# EAGLE design Wheelmod_rs485 (EAGLE 7.3.0)
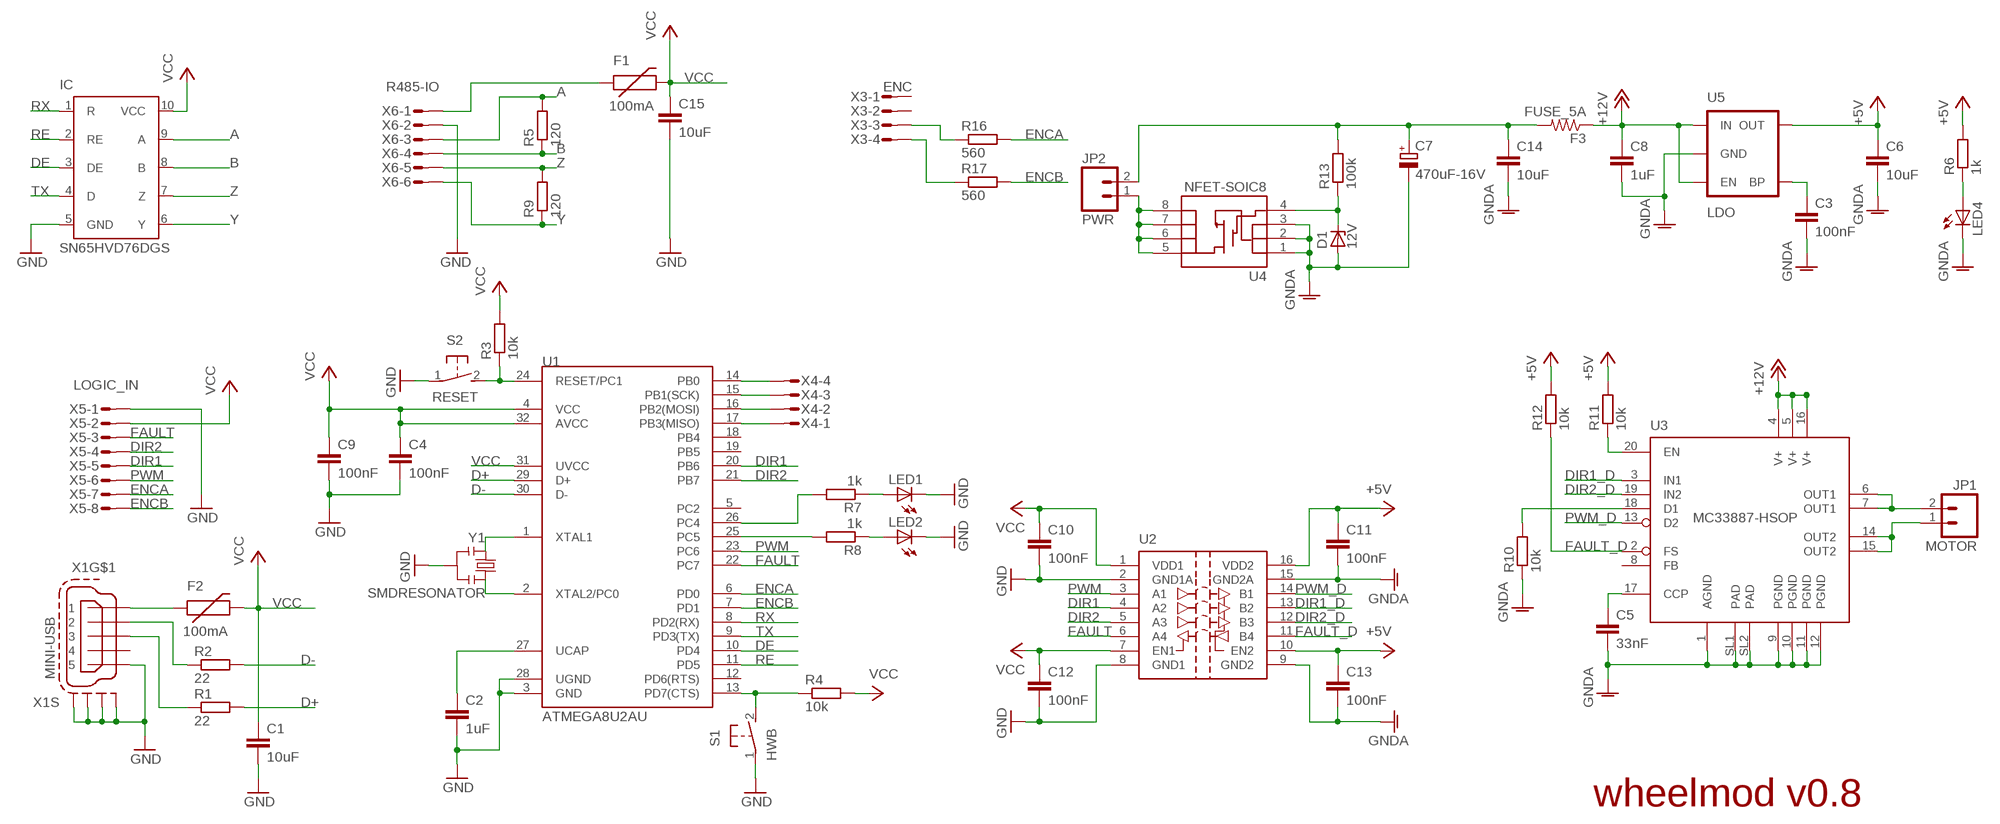
[diagram p0: schematic, sheet 1]

## Parts
C1  10uF  C-EUC1206K  [C1206K]
C2  1uF  C-EUC0603K  [C0603K]
C3  100nF  C-EUC0603K  [C0603K]
C4  100nF  C-EUC0603K  [C0603K]
C5  33nF  C-EUC0603K  [C0603K]
C6  10uF  C-EUC1206K  [C1206K]
C7  470uF-16V  CPOL-EUE3.5-8  [E3,5-8]
C8  1uF  C-EUC0603K  [C0603K]
C9  100nF  C-EUC0603K  [C0603K]
C10  100nF  C-EUC0603K  [C0603K]
C11  100nF  C-EUC0603K  [C0603K]
C12  100nF  C-EUC0603K  [C0603K]
C13  100nF  C-EUC0603K  [C0603K]
C14  10uF  C-EUC1206K  [C1206K]
C15  10uF  C-EUC1206K  [C1206K]
D1  12V  ZENER-DIODESOD123  [SOD123]
F1  100mA  PTCSMD  [PTC-1206]
F2  100mA  PTCSMD  [PTC-1206]
F3  FUSE_5A  R-US_R1206  [R1206]
JP1  MOTOR  M023.5MM  [SCREWTERMINAL-3.5MM-2]
JP2  PWR  M023.5MM  [SCREWTERMINAL-3.5MM-2]
LED1  LEDCHIP-LED0603  [CHIP-LED0603]
LED2  LEDCHIP-LED0603  [CHIP-LED0603]
LED4  LEDCHIP-LED0603  [CHIP-LED0603]
R1  22  R-EU_R0603  [R0603]
R2  22  R-EU_R0603  [R0603]
R3  10k  R-EU_R0603  [R0603]
R4  10k  R-EU_R0603  [R0603]
R5  120  R-EU_R0603  [R0603]
R6  1k  R-EU_R0603  [R0603]
R7  1k  R-EU_R0603  [R0603]
R8  1k  R-EU_R0603  [R0603]
R9  120  R-EU_R0603  [R0603]
R10  10k  R-EU_R0603  [R0603]
R11  10k  R-EU_R0603  [R0603]
R12  10k  R-EU_R0603  [R0603]
R13  100k  R-EU_R0603  [R0603]
R16  560  R-EU_R0603  [R0603]
R17  560  R-EU_R0603  [R0603]
S1  HWB  ADTSM3  [ADTSM3]
S2  RESET  ADTSM3  [ADTSM3]
U1  ATMEGA8U2AU  [TQFP32-08]
U2  SI8441IS1  [SO16]
U3  MC33887-HSOP  [HSOP]
U4  NFET-SOIC8  MOSFET-NCHANNEL-SOIC8  [SO08]
U5  LDO  V_REG_LDOSMD  [SOT23-5]
U$1  SN65HVF76DGS  [MSOP10]
X1  MINI-USB  MINI-USB-SCHIELD-32005-301  [32005-301]
X3  ENC  MICROMATCH-4  [MICROMATCH-4]
X4  MICROMATCH-4  [MICROMATCH-4]
X5  LOGIC_IN  MICROMATCH-8  [MICROMATCH-8]
X6  R485-IO  MICROMATCH-6  [MICROMATCH-6]
Y1  SMDRESONATOR  SMDRESONATOR45X20  [PBRC-M]

## Nets
+5V: C6.1 C11.1 C13.1 R6.2 R11.2 R12.2 U2.10(EN2) U2.16(VDD2) U5.5(OUT)
+12V: C8.1 F3.1 U3.4(V+) U3.5(V+) U3.16(V+) U5.1(IN) U5.3(EN)
A: R5.2 U$1.9(A) X6.3
B: R5.1 U$1.8(B) X6.4
D+: R1.2 U1.29(D+)
D-: R2.2 U1.30(D-)
DE: U1.10(PD4) U$1.3(DE)
DIR1: U1.20(PB6) U2.4(A2) X5.5
DIR1_D: U2.13(B2) U3.3(IN1)
DIR2: U1.21(PB7) U2.5(A3) X5.4
DIR2_D: U2.12(B3) U3.19(IN2)
ENCA: R16.2 U1.6(PD0) X5.7
ENCB: R17.2 U1.7(PD1) X5.8
FAULT: U1.22(PC7) U2.6(A4) X5.3
FAULT_D: R12.1 U2.11(B4) U3.2(FS)
GND: C1.2 C2.2 C4.2 C9.2 C10.2 C12.2 C15.2 LED1.C LED2.C S1.1 S2.1 U1.3(GND) U1.28(UGND) U2.2(GND1A) U2.8(GND1) U$1.5(GND) X1.5 X1.M1(S:S1) X1.M2(S:S2) X1.M3(S:S3) X1.M4(S:S4) X5.1 X6.2 Y1.2
GNDA: C3.2 C5.2 C6.2 C7.- C8.2 C11.2 C13.2 C14.2 D1.A LED4.C R10.1 U2.9(GND2) U2.15(GND2A) U3.1(AGND) U3.9(PGND) U3.10(PGND) U3.11(PGND) U3.12(PGND) U3.SL1(PAD) U3.SL2(PAD) U4.1(S) U4.2(S) U4.3(S) U5.2(GND)
N$1: C2.1 U1.27(UCAP)
N$2: R4.1 S1.2 U1.13(PD7(CTS))
N$3: LED1.A R7.1
N$4: LED2.A R8.1
N$5: R1.1 X1.3
N$6: F2.1 X1.1
N$7: R2.1 X1.2
N$8: U1.1(XTAL1) Y1.1
N$9: U1.2(XTAL2/PC0) Y1.3
N$10: R3.1 S2.2 U1.24(RESET/PC1)
N$11: C3.1 U5.4(BP)
N$12: R8.2 U1.25(PC5)
N$13: LED4.A R6.1
N$15: C5.1 U3.17(CCP)
N$17: R11.1 U3.20(EN)
N$18: R10.2 U3.18(D1)
N$19: R7.2 U1.26(PC4)
N$20: D1.C R13.1 U4.4(G)
N$21: JP2.1 U4.5(D) U4.6(D) U4.7(D) U4.8(D)
N$23: JP1.2 U3.6(OUT1) U3.7(OUT1)
N$24: U1.14(PB0) X4.4
N$25: JP1.1 U3.14(OUT2) U3.15(OUT2)
N$26: U1.15(PB1(SCK)) X4.3
N$27: U1.16(PB2(MOSI)) X4.2
N$28: R16.1 X3.3
N$29: R17.1 X3.4
N$30: C7.+ C14.1 F3.2 JP2.2 R13.2
N$31: U1.17(PB3(MISO)) X4.1
N$33: F1.1 X6.1
PWM: U1.23(PC6) U2.3(A1) X5.6
PWM_D: U2.14(B1) U3.13(D2)
RE: U1.11(PD5) U$1.2(RE)
RX: U1.8(PD2(RX)) U$1.1(R)
TX: U1.9(PD3(TX)) U$1.4(D)
VCC: C1.1 C4.1 C9.1 C10.1 C12.1 C15.1 F1.2 F2.2 R3.2 R4.2 U1.4(VCC) U1.31(UVCC) U1.32(AVCC) U2.1(VDD1) U2.7(EN1) U$1.10(VCC) X5.2
Y: R9.1 U$1.6(Y) X6.6
Z: R9.2 U$1.7(Z) X6.5
Unconnected: U1.5(PC2) U1.12(PD6(RTS)) U1.18(PB4) U1.19(PB5) U3.8(FB) X1.4 X3.1 X3.2

## Notes on the sheet
- wheelmod v0.8

## Library data of the parts
C1-C6 C8-C15 = rcl:C-EU: CAPACITOR, European symbol
C7 = rcl:CPOL-EU: POLARIZED CAPACITOR, European symbol
D1 = diode:ZENER-DIODE: Z-Diode
F1 F2 = SparkFun:PTC: Resettable Fuse PTC Resettable Fuse. Spark Fun Electronics SKU : COM-08357
F3 = rcl:R-US_: RESISTOR, American symbol
JP1 JP2 = SparkFun:M02: Header 2 Standard 2-pin 0.1" header. Use with straight break away headers (SKU : PRT-00116), right angle break away headers (PRT-00553), swiss pins (PRT-00743), machine pins (PRT-00117), and female headers (PRT-00115). Molex polarized connector foot print use with SKU : PRT-08233 with associated crimp pins and housings.
LED1 LED2 LED4 = led:LED: LED OSRAM: - CHIPLED LG R971, LG N971, LY N971, LG Q971, LY Q971, LO R971, LY R971 LH N974, LH R974 LS Q976, LO Q976, LY Q976 LO Q996 - Hyper CHIPLED LW Q18S LB Q993, LB Q99A, LB R99A - SideLED LS A670, LO A670, LY A670, LG A670, LP A670 LB A673, LV A673, LT A673, LW A673 LH A674 LY A675 LS A676, LA A676, LO A676, LY A676, LW A676 LS A679, LY A679, LG A679 - Hyper Micro SIDELED® LS Y876, LA Y876, LO Y876, LY Y876 LT Y87S - SmartLED LW L88C, LW L88S LB L89C, LB L89S, LG L890 LS L89K, LO L89K, LY L89K LS L896, LA L896, LO L896, LY L896 - TOPLED LS T670, LO T670, LY T670, LG T670, LP T670 LSG T670, LSP T670, LSY T670, LOP T670, LYG T670 LG T671, LOG T671, LSG T671 LB T673, LV T673, LT T673, LW T673 LH T674 LS T676, LA T676, LO T676, LY T676, LB T676, LH T676, LSB T676, LW T676 LB T67C, LV T67C, LT T67C, LS T67K, LO T67K, LY T67K, LW E67C LS E67B, LA E67B, LO E67B, LY E67B, LB E67C, LV E67C, LT E67C LW T67C LS T679, LY T679, LG T679 LS T770, LO T770, LY T770, LG T770, LP T770 LB T773, LV T773, LT T773, LW T773 LH T774 LS E675, LA E675, LY E675, LS T675 LS T776, LA T776, LO T776, LY T776, LB T776 LHGB T686 LT T68C, LB T68C - Hyper Mini TOPLED® LB M676 - Mini TOPLED Santana® LG M470 LS M47K, LO M47K, LY M47K Source: http://www.osram.convergy.de LUXEON: - LUMILED® LXK2-PW12-R00, LXK2-PW12-S00, LXK2-PW14-U00, LXK2-PW14-V00 LXK2-PM12-R00, LXK2-PM12-S00, LXK2-PM14-U00 LXK2-PE12-Q00, LXK2-PE12-R00, LXK2-PE12-S00, LXK2-PE14-T00, LXK2-PE14-U00 LXK2-PB12-K00, LXK2-PB12-L00, LXK2-PB12-M00, LXK2-PB14-N00, LXK2-PB14-P00, LXK2-PB14-Q00 LXK2-PR12-L00, LXK2-PR12-M00, LXK2-PR14-Q00, LXK2-PR14-R00 LXK2-PD12-Q00, LXK2-PD12-R00, LXK2-PD12-S00 LXK2-PH12-R00, LXK2-PH12-S00 LXK2-PL12-P00, LXK2-PL12-Q00, LXK2-PL12-R00 Source: www.luxeon.com KINGBRIGHT: KA-3528ASYC Source: www.kingbright.com
R1-R13 R16 R17 = rcl:R-EU_: RESISTOR, European symbol
S1 S2 = kommunikatsioonimoodul:ADTSM3
U1 = SparkFun:ATMEGA8U2: Atmel 8-bit Microcontroller with 8/16/32K Bystes of ISP Flash and USB Controller. ATmega8U2, ATmega16U2, and ATmega32U2
U2 = silicon-labs:SI8441: Si8441 4 Channel (3/1) Digital Isolator Silicon Labs Si84xx ISOpro digital isolator series. The Si84xx ISOpro digital isolators provide low power galvanic isolation for digital signals. The '41 has three forward and one reverse channel, with output enables. This part is suitable for four wire SPI: unidirectional signals with clock and chip select. They come in speeds of 1Mbps and 150Mbps, and isolation ratings of 1KV, 2.5KV and 5KV. The independent sides use 2.7-5.5V supplies and draw under 5mA per channel. Donald Becker
U3 = mc33887:MC33887-HSOP: 5.0 A H-Bridge with Load Current Feedback
U4 = SparkFun:MOSFET-NCHANNEL-SOIC8: N-Channel MOSFET IRF9410 and NDS8434 are common, SOIC-8 parts.
U5 = SparkFun:V_REG_LDO: Voltage Regulator LDO Standard 150mA LDO voltage regulator in SOT-23 layout. Micrel part MIC5205. BP (by-pass) pin is used to lower output noise with 470pF cap.
U$1 = rs485:SN65HVF76DGS
X1 = con-cypressindustries:MINI-USB-SCHIELD-: MINI USB-B Conector Source: www.cypressindustries.com; OC_FARNELL: unknown; OC_NEWARK: unknown
X3 X4 = con-amp-micromatch:MICROMATCH-4: MicroMaTch 4 7-215464-4 / 0-215464-4 Drawing Number C-215464 DDEController.pdf; MPN: 7-215464-4; OC_FARNELL: 3784629; OC_NEWARK: 19R8124
X5 = con-amp-micromatch:MICROMATCH-8: MicroMaTch 8 7-215464-8 / 0-215464-8 Drawing Number C-215464 DDEController.pdf; MF: FARNELL; MPN: 7-215464-8; OC_FARNELL: 3784642; OC_NEWARK: 26H0301
X6 = con-amp-micromatch:MICROMATCH-6: MicroMaTch 6 7-215464-6 / 0-215464-6 Drawing Number C-215464 DDEController.pdf; MPN: 7-215464-6; OC_FARNELL: 3784630; OC_NEWARK: 19R8125
Y1 = reiko:SMDRESONATOR45X20

## Board
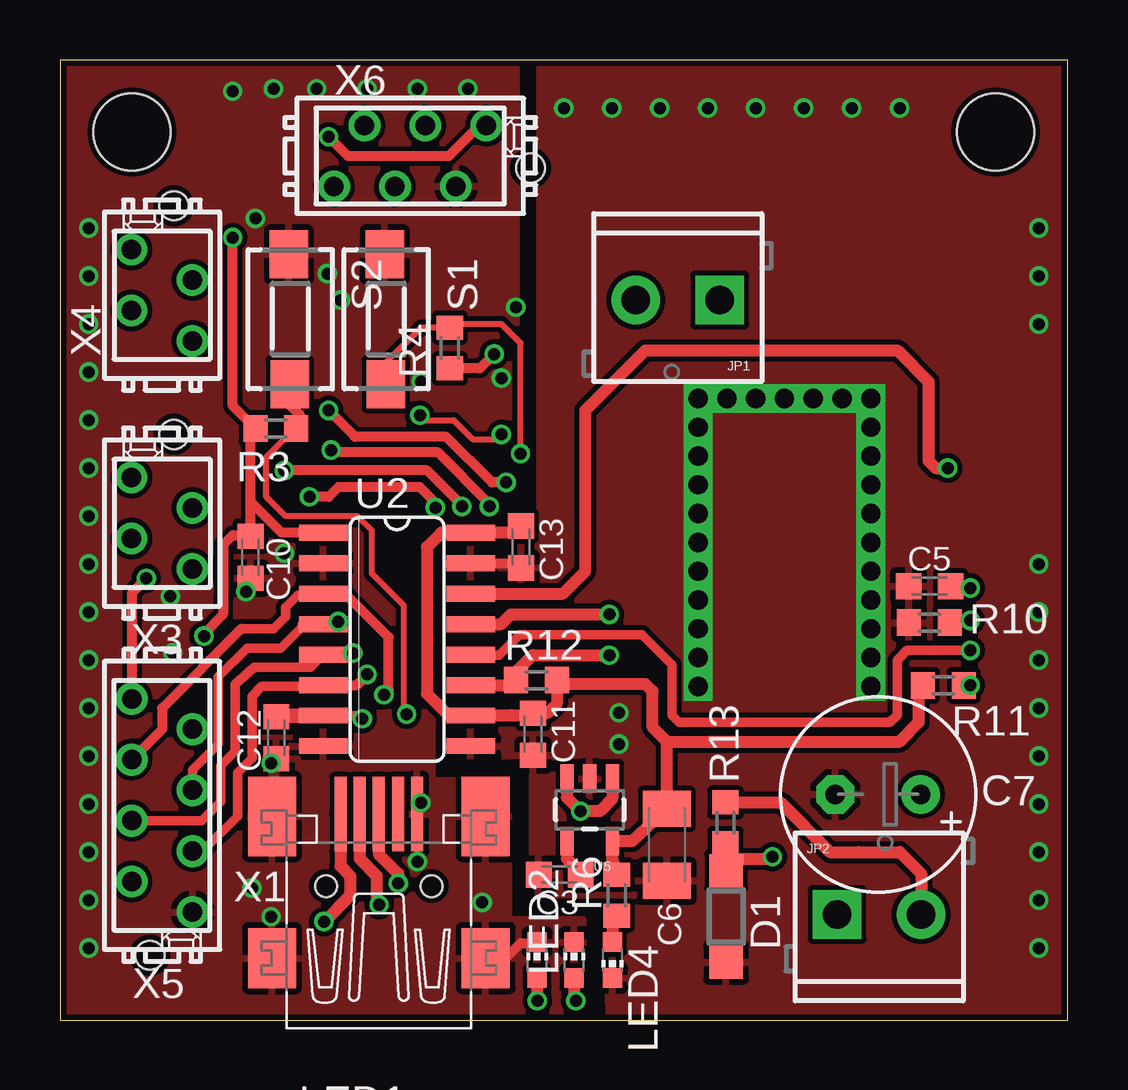
[diagram p1: board, top side]
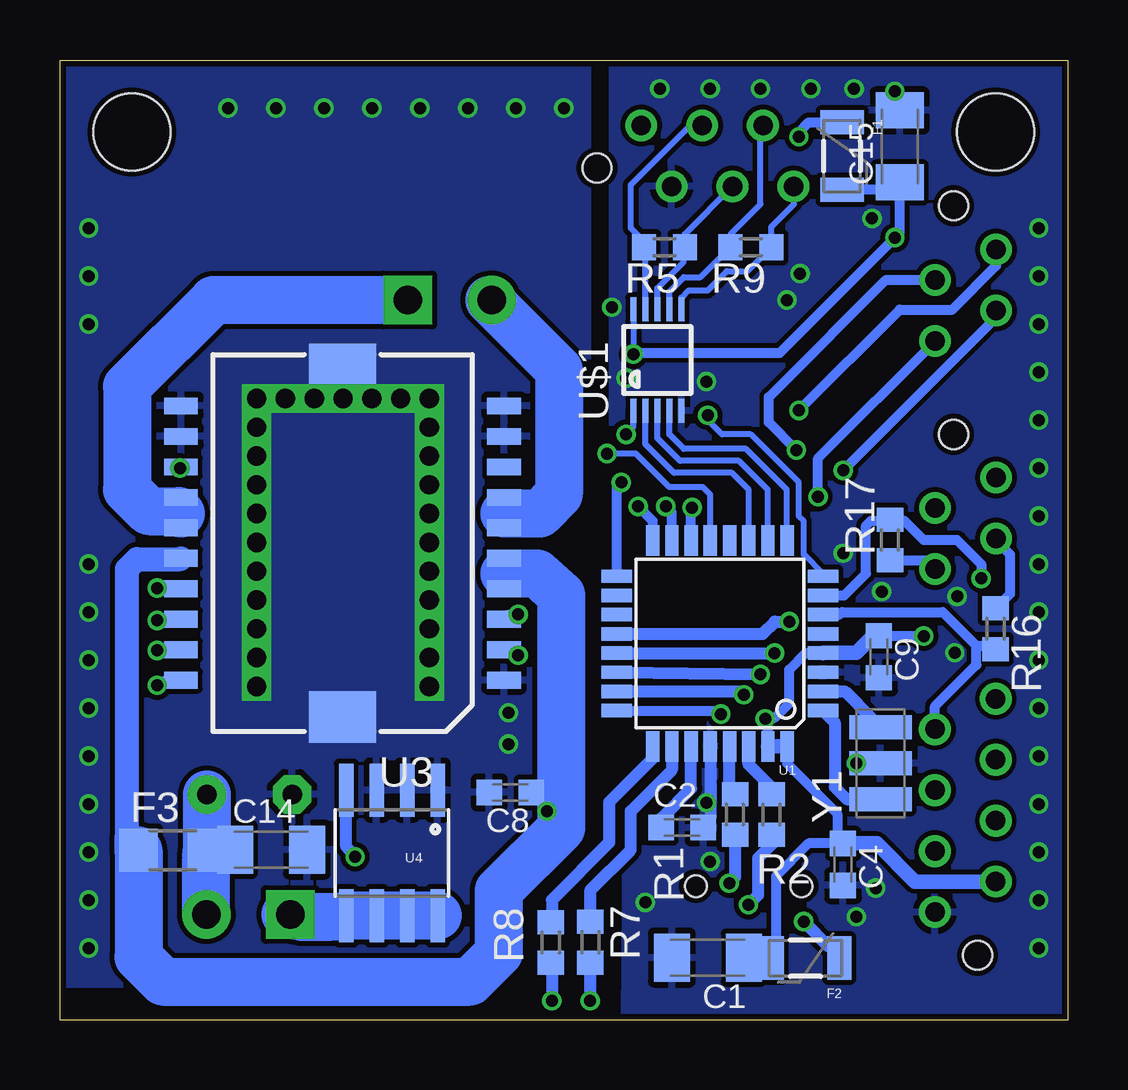
[diagram p2: board, bottom side, seen from below]

Size 42 x 40 mm. Coordinates in mm from the lower left corner, seen from the top.
Outline: 0,0 42,0 42,40 0,40 0,0
Copper layers (1*16): Top 0.035mm / dielectric 1.5mm / Bottom 0.035mm
Design rules "default": minimum track width 6mil, minimum drill 12mil, track to track 8mil, track to pad 8mil, pad to pad 8mil, via to via 8mil, smd to smd 0mil, copper to edge 10mil, drill to drill 10mil, minimum pad ring 10mil, minimum via ring 6mil, stop-mask expansion 2mil, vias tented up to drill 100mil, thermal gap 10mil
Holes 1.2 mm at 3.75,2.7 4.75,24.4 4.75,33.93 19.61,35.5
Holes 3.2 mm at 39,37 3,37
bRestrict: area 10.9,14 to 11.5,14.9

### Footprints (pad centres in the part's own frame; a part is rotated, then mirrored left to right if it is on the bottom)
C1206K = smd 1.5 x 2: 1 -1.5,0; 2 1.5,0
C0603K = smd 1.05 x 1.08: 1 -0.875,0; 2 0.875,0
E3,5-8 = drill 0.813 pad 1.6: + -1.778,0 | drill 0.813 pad 1.6 octagon: - 1.778,0
SOD123 = smd 1.4 x 1.4: A 1.9,0; C -1.9,0
PTC-1206 = smd 1 x 1.8: 1 -1.4,0; 2 1.4,0
R1206 = smd 1.6 x 1.803: 1 -1.422,0; 2 1.422,0
SCREWTERMINAL-3.5MM-2 = drill 1.2 pad 2.032 square: 1 0,0 | drill 1.2 pad 2.032: 2 3.5,0
CHIP-LED0603 = smd 0.8 x 0.8: A 0,-0.75; C 0,0.75
R0603 = smd 1 x 1.1: 1 -0.85,0; 2 0.85,0
ADTSM3 = smd 2 x 1.6: 1 -2.7,-0.06; 2 2.7,-0.02
TQFP32-08 = smd 1.27 x 0.559: 1 -4.293,2.8; 2 -4.293,2; 3 -4.293,1.2; 4 -4.293,0.4; 5 -4.293,-0.4; 6 -4.293,-1.2; 7 -4.293,-2; 8 -4.293,-2.8; 17 4.293,-2.8; 18 4.293,-2; 19 4.293,-1.2; 20 4.293,-0.4; 21 4.293,0.4; 22 4.293,1.2; 23 4.293,2; 24 4.293,2.8 | smd 0.559 x 1.27: 9 -2.8,-4.293; 10 -2,-4.293; 11 -1.2,-4.293; 12 -0.4,-4.293; 13 0.4,-4.293; 14 1.2,-4.293; 15 2,-4.293; 16 2.8,-4.293; 25 2.8,4.293; 26 2,4.293; 27 1.2,4.293; 28 0.4,4.293; 29 -0.4,4.293; 30 -1.2,4.293; 31 -2,4.293; 32 -2.8,4.293
SO16 = smd 0.66 x 2.032: 1 -4.445,-3.073; 2 -3.175,-3.073; 3 -1.905,-3.073; 4 -0.635,-3.073; 5 0.635,-3.073; 6 1.905,-3.073; 7 3.175,-3.073; 8 4.445,-3.073; 9 4.445,3.073; 10 3.175,3.073; 11 1.905,3.073; 12 0.635,3.073; 13 -0.635,3.073; 14 -1.905,3.073; 15 -3.175,3.073; 16 -4.445,3.073
HSOP = smd 0.7 x 1.4: 1 -5.715,-6.731; 2 -4.445,-6.731; 3 -3.175,-6.731; 4 -1.905,-6.731; 5 -0.635,-6.731; 6 0.635,-6.731; 7 1.905,-6.731; 8 3.175,-6.731; 9 4.445,-6.731; 10 5.715,-6.731; 11 5.715,6.731; 12 4.445,6.731; 13 3.175,6.731; 14 1.905,6.731; 15 0.635,6.731; 16 -0.635,6.731; 17 -1.905,6.731; 18 -3.175,6.731; 19 -4.445,6.731; 20 -5.715,6.731 | smd 2.15 x 2.8: SL1 -7.239,0; SL2 7.239,0
SO08 = smd 0.61 x 2.21: 1 -1.905,-2.616; 2 -0.635,-2.616; 3 0.635,-2.616; 4 1.905,-2.616; 5 1.905,2.616; 6 0.635,2.616; 7 -0.635,2.616; 8 -1.905,2.616
SOT23-5 = smd 0.55 x 1.2: 1 -0.95,-1.3; 2 0,-1.3; 3 0.95,-1.3; 4 0.95,1.3; 5 -0.95,1.3
MSOP10 = smd 0.25 x 1: 1 -1,-2.113; 2 -0.5,-2.113; 3 0,-2.113; 4 0.5,-2.113; 5 1,-2.113; 6 1,2.113; 7 0.5,2.113; 8 0,2.113; 9 -0.5,2.113; 10 -1,2.113
32005-301 = smd 3.1 x 0.5: 1 3,1.6; 2 3,0.8; 3 3,0; 4 3,-0.8; 5 3,-1.6 | smd 2.5 x 2: M1 -3,-4.45; M2 -3,4.45 | smd 3.3 x 2: M3 2.9,4.45; M4 2.9,-4.45 | hole 0.9: 0,2.2; 0,-2.2
MICROMATCH-4 = drill 0.813: 1 1.905,1.27; 2 0.635,-1.27; 3 -0.635,1.27; 4 -1.905,-1.27
MICROMATCH-8 = drill 0.813: 1 4.445,1.27; 2 3.175,-1.27; 3 1.905,1.27; 4 0.635,-1.27; 5 -0.635,1.27; 6 -1.905,-1.27; 7 -3.175,1.27; 8 -4.445,-1.27
MICROMATCH-6 = drill 0.813: 1 3.175,1.27; 2 1.905,-1.27; 3 0.635,1.27; 4 -0.635,-1.27; 5 -1.905,1.27; 6 -3.175,-1.27
PBRC-M = smd 1 x 2.6: 1 -1.5,0; 2 0,0; 3 1.5,0

### Placement (x,y rotation side)
C1  15,2.6 180 bottom
C2  16.06,8.02 0 bottom
C3  20.83,6.06 180 top
C4  9.36,6.48 270 bottom
C5  36.25,18.08 180 top
C6  25.3,7.3 270 top
C7  34.1,9.4 180 top
C8  23.23,9.48 180 bottom
C9  7.86,15.13 270 bottom
C10  7.94,19.28 270 top
C11  19.72,11.91 270 top
C12  9.02,11.76 270 top
C13  19.22,19.71 270 top
C14  33.2,7.1 0 bottom
C15  7,36.4 90 bottom
D1  27.77,4.31 270 top
F1  9.4,36 270 bottom
F2  10.92,2.58 180 bottom
F3  37.3,7.07 0 bottom
JP1  27.5,30 180 top
JP2  32.4,4.4 0 top
LED1  19.89,2.5 0 top
LED2  21.43,2.5 0 top
LED4  23.03,2.5 180 top
R1  13.86,8.56 90 bottom
R2  12.34,8.56 90 bottom
R3  9,24.64 180 top
R4  16.25,28 270 top
R5  16.8,32.2 180 bottom
R6  23.21,5.2 90 top
R7  19.89,3.24 90 bottom
R8  21.54,3.23 90 bottom
R9  13.2,32.2 180 bottom
R10  36.24,16.56 0 top
R11  36.82,13.94 180 top
R12  19.86,14.16 0 top
R13  27.74,8.22 90 top
R16  3,16.3 270 bottom
R17  7.4,20 90 bottom
S1  13.6,29.2 270 top
S2  9.6,29.2 270 top
U1  14.49,15.69 180 bottom
U2  14.05,15.86 270 top
U3  30.22,19.87 90 bottom
U4  28.16,6.96 180 bottom
U5  22.08,8.76 180 top
U$1  17.1,27.5 0 bottom
X1  13.29,5.58 90 top
X3  4.25,20.7 90 top
X4  4.25,30.2 90 top
X5  4.26,8.94 270 top
X6  14.6,36 0 top
Y1  7.8,10.7 90 bottom

### Tracks (layer width: path | path; a pad name or v marks a point on that pad's centre or on a via)
+5V
  Top 0.3: 35.8,13.91 R11.2 | 20.85,14 R12.2
  Top 0.5: C13.1 18.74,20.3 U2.16 15.9,20.3 15.3,19.7 15.3,13.6 16.2,12.7 18.81,12.7 U2.10 19.42,12.69 C11.1 20.32,12.79 20.71,13.18 R12.2 | 25.3,11.6 35,11.6 35.8,12.4 35.8,13.91 | R6.2 23.03,6.69 U5.5 23.86,7.46 C6.1 25.3,11.6 | 20.85,14 24.4,14 24.7,13.7 24.7,12.2 25.3,11.6
+12V  (via drill 0.5)
  Top 0.5: U5.1 23.03,9.23 22.5,8.7 v21.7,8.7 21.13,9.27 U5.3
  Bottom 0.5: U3.5 23.49,18.6 U3.4 | v21.7,8.7 21.92,9.74 | 21.92,9.74 21.1,10 | C8.1 22.18,9.48 21.92,9.74
  Bottom 1: F3.1 39.22,7.22 39.2,8.2 39.2,18.8 38.8,19.2 36.99,19.2 U3.16
  Bottom 2: F3.1 38.72,2.62 37.7,1.6 24.9,1.6 23.7,2.8 23.7,5.4 21.1,8 21.1,10 21.1,17.7 22.1,18.6 23.49,18.6
A
  Bottom 0.254: U$1.9 17.6,32.15 R5.2 17.65,32.45 18.2,33 18.2,34.8 15.73,37.27 X6.3
B
  Bottom 0.254: U$1.8 17.1,30.5 16,31.6 16,32.15 R5.1 15.95,32.74 X6.4
D+
  Bottom 0.5: R1.2 14.09,9.53 U1.29
D-
  Bottom 0.3: 13.3,11.39 U1.30
  Bottom 0.5: R2.2 12.34,9.69 13.3,10.65 13.3,11.39
DE
  Bottom 0.254: U$1.3 17.1,24.25 16.15,23.3 13.7,23.3 12.5,22.1 12.5,19.99
  Bottom 0.5: 12.5,19.99 U1.10
DIR1  (via drill 0.5)
  Top 0.3: v11.6,16.6 11.51,16.5 U2.4 10.1,16.5
  Top 0.4: X5.5 5.53,10.43 6.6,11.5 6.6,14.3 7.8,15.5 9.2,15.5 10.1,16.39 10.1,16.5
  Bottom 0.5: U1.20 12.71,16.09 12.2,16.6 v11.6,16.6
DIR1_D  (via drill 0.5)
  Top 0.5: U2.13 18.39,16.5 18.8,16.9 v22.9,16.9
  Bottom 0.3: 23.5,16.81 U3.3
  Bottom 0.5: v22.9,16.9 23.5,16.81
DIR2  (via drill 0.5)
  Top 0.3: U2.5 11.53,15.22 | X5.4
  Top 0.4: X5.4 5.9,8.3 6.7,9.1 6.7,10.6 7.3,11.2 7.3,14 8.1,14.7 10.45,14.7 U2.5
  Top 0.406: 11.53,15.22 11.59,15.29 v12.21,15.29 v12.2,15.3
  Bottom 0.5: U1.21 v12.21,15.29
DIR2_D  (via drill 0.5)
  Top 0.3: 17.15,15.2 U2.12
  Top 0.4: 17.15,15.2 18.3,15.2 19.15,16.05 24.25,16.05 25.5,14.8 25.5,12.7 25.8,12.4 34.6,12.4 34.9,12.7 34.9,15 35.3,15.4 v37.95,15.4
  Bottom 0.3: U3.19 37.23,15.43
  Bottom 0.5: 37.23,15.43 v37.95,15.4
ENCA
  Bottom 0.3: U1.6 10.19,16.9
  Bottom 0.406: 3,15.4 R16.2 3.15,15.6 3.8,15.6 | 3.8,15.6 5.2,17 9.4,17 9.51,16.89 U1.6 | X5.7 5.53,13.07 3.8,14.8 3.8,15.6
ENCB  (via drill 0.5)
  Top 0.406: X5.8 3,13.4 3,17.8 v3.6,18.4
  Bottom 0.406: U1.7 9.31,17.69 8.4,18.6 8.4,20.6 8.2,20.8 7.45,20.8 R17.2 7.35,20.8 6.8,20.8 6,20 4.6,20 3.6,19 v3.6,18.4
FAULT  (via drill 0.5)
  Top 0.3: 11.76,13.96 U2.6 10.14,13.96 10,13.9
  Top 0.4: 10,13.9 8.4,13.9 8,13.5 8,10.9 7.4,10.3 7.4,8.5 5.93,7.04 X5.3
  Top 0.406: 11.76,13.96 12.36,13.96 v12.8,14.4
  Bottom 0.3: U1.22
  Bottom 0.5: U1.22 v12.8,14.4
FAULT_D  (via drill 0.5)
  Top 0.3: R12.1 19.11,14.61
  Top 0.5: U2.11 18.7,13.96 R12.1 | 19.11,14.61 19.7,15.2 v22.9,15.2
  Bottom 0.3: 23.5,15.41 U3.2
  Bottom 0.5: v22.9,15.2 23.5,15.41
GND  (via drill 0.5)
  Top 0.406: X1.M1 18.58,2.58 19.2,3.2 19.84,3.2 LED1.C
  Top 0.5: X1.5 14.9,8.77 | C12.2 9.11,10.8 v8.8,10.7
  Bottom 0.5: U1.28 14.89,8.41 C2.2 14.9,8.3 | Y1.2 v8.8,10.7
  other vias: 1.2,15 1.2,13 1.2,11 1.2,9 1.2,7 1.2,5 1.2,3 14.9,6.6 1.2,25 1.2,23 1.2,21 1.2,19 1.2,17 7.2,38.7 14.9,38.8 12.8,38.8 10.7,38.8 8.9,38.8 1.2,29 1.2,27 17,38.8 1.2,31 1.2,33 4.7,15.3 17.6,4.9 8,5.5 8.8,4.3 15.05,9.05 4.6,17.65 9.35,19.45 7.75,17.85 11.7,30 15.05,26.6 19,29.7 18.4,26.75 11.15,31.1 8.15,33.4
  pour Top: 0,40 19,40 19,21 15.5,21 15.5,10 18.7,10 18.7,4.2 21.8,4.2 21.8,0 0,0
  pour Bottom: 0,40 19,40 19,12.7 18.4,10 18.5,0 0,0
GNDA  (via drill 0.5, 0.8)
  Top 0.406: U2.15 19.02,19.04 C13.2
  Top 0.5: U5.2 22.1,10.08
  other vias: 23,38 21,38 33,38 31,38 27,38 25,38 40.8,7 40.8,5 40.8,3 40.8,15 40.8,11 40.8,9 40.8,19 40.8,17 23.3,12.8 23.3,11.5 26.6,13.9 33.8,13.9 35,38 26.6,15.1 33.8,15.1 26.6,16.3 33.8,16.3 26.6,17.5 33.8,17.5 26.6,18.7 33.8,18.7 26.6,19.9 33.8,19.9 26.6,21.1 33.8,21.1 26.6,22.3 33.8,22.3 26.6,23.5 33.8,23.5 26.6,24.7 33.8,24.7 26.6,25.9 27.8,25.9 29,25.9 30.2,25.9 33.8,25.9 31.4,25.9 32.6,25.9 29,38 40.8,13 40.8,29 40.8,31 40.8,33
  pour Top (rank 2): 42,40 42,0 22.9,-0.1 22.7,5.2 19.7,5.2 19.7,11 16.1,11 16.1,21 20,21 20,40
  pour Bottom (rank 2): 42,40 42,1.5 25.3,1.5 23.2,4.7 20,10 20,40
  pour Bottom: 26.4,26.2 34,26.2 34,13.6 26.4,13.6
N$1
  Bottom 0.5: U1.27 15.69,9.65 16.93,8.41 C2.1
N$2  (via drill 0.5)
  Top 0.254: v19.2,23.6 19.2,28.2 18.4,29 16.4,29 R4.1 15.05,28.85 13.6,27.4 13.6,26.52 S1.2
  Bottom 0.254: U1.13 14.89,21.89 15.2,22.2 16.6,22.2 18,23.6 v19.2,23.6
N$3  (via drill 0.5)
  Top 0.5: LED1.A 19.89,1.1 v19.9,0.8
  Bottom 0.3: R7.1 19.94,2.34 19.84,2.35 19.89,2.3
  Bottom 0.5: 19.89,2.3 19.9,2.29 v19.9,0.8
N$4  (via drill 0.5)
  Top 0.5: LED2.A 21.43,1 v21.5,0.8
  Bottom 0.5: R8.1 21.5,2.34 v21.5,0.8
N$5  (via drill 0.5)
  Top 0.5: X1.3 13.29,6.91 14.1,6.1 v14.1,5.7
  Bottom 0.5: R1.1 13.86,5.96 v14.1,5.7
N$6  (via drill 0.5)
  Top 0.5: X1.1 11.69,6.41 12.1,6 12.1,5.2 v11,4.1
  Bottom 0.5: F2.1 9.8,3.06 9.96,3.06 v11,4.1
N$7  (via drill 0.5)
  Top 0.5: X1.2 12.49,6.71 13.2,6 13.2,4.9 v13.3,4.8
  Bottom 0.5: v13.3,4.8 12.9,5.2 12.9,6.75 12.34,7.31 R2.1
N$8
  Bottom 0.5: U1.1 9.7,12.39 9.7,9.7 9.2,9.2 Y1.1
N$9
  Bottom 0.3: 8.2,12.6 Y1.3
  Bottom 0.5: U1.2 9.29,13.69 8.2,12.6
N$10  (via drill 0.5)
  Top 0.254: v14.45,12.75 14.34,12.86 14.34,17.26 13,18.6 13,20.4 12.4,21 9.4,21 8.6,21.8 8.6,23.45 9.79,24.64 R3.1
  Top 0.406: S2.2 9.58,25.62 10,25.2 10,24.79 R3.1
  Bottom 0.406: U1.24 14.59,12.89 v14.45,12.75
N$11
  Top 0.5: U5.4 21.13,6.74 C3.1
N$12
  Bottom 0.3: 21.5,4.12 R8.2
  Bottom 0.5: 21.5,4.12 21.5,5 19.1,7.4 19.1,9.09 17.29,10.9 U1.25
N$13
  Top 0.3: R6.1 23.03,3.89
  Top 0.5: 23.03,3.89 LED4.A
N$15  (via drill 0.5)
  Top 0.3: 37.1,18.1 C5.1
  Top 0.5: v37.95,18 37.1,18.1
  Bottom 0.3: v37.95,18 37.09,18.1 U3.17
N$17  (via drill 0.5)
  Top 0.406: v37.95,13.95 37.6,13.9 37.61,13.9 R11.1
  Bottom 0.406: 37.41,14.2 U3.20
  Bottom 0.5: v37.95,13.95 37.41,14.2
N$18  (via drill 0.5)
  Top 0.3: R10.2 37.09,16.51
  Top 0.5: 37.09,16.51 v37.95,16.65
  Bottom 0.3: U3.18 37.05,16.65
  Bottom 0.5: 37.05,16.65 v37.95,16.65
N$19
  Bottom 0.3: 20.15,4.03 R7.2 19.9,4.38
  Bottom 0.5: U1.26 16.49,10.41 18.2,8.7 18.2,7.1 19.9,5.4 19.9,4.38
N$20  (via drill 0.5)
  Top 0.5: D1.C 27.77,6.7 | 27.77,6.7 27.77,7.44 R13.1 | v29.7,6.8 29.6,6.7 27.77,6.7
  Bottom 0.5: v29.7,6.8 30.07,7.24 U4.4
N$21
  Bottom 2: U4.8 U4.7 U4.6 U4.5 30.81,4.3 31.9,4.3 32.6,4.4 JP2.1
N$23
  Bottom 0.5: U3.7 23.49,21.1 U3.6
  Bottom 2: JP1.2 24.1,30 21.2,27.1 21.2,21.9 22,21.1 23.49,21.1
N$24  (via drill 0.5)
  Top 0.406: v15.65,21.35 15.65,21.55 15,22.2 11.6,22.2 11.2,21.8 v10.4,21.8
  Bottom 0.254: X4.4
  Bottom 0.406: U1.14 15.69,21.31 v15.65,21.35 | v10.4,21.8 10.4,23.4 X4.4
N$25
  Bottom 0.5: U3.14 36.95,21.1 U3.15
  Bottom 2: JP1.1 35.6,30 39.2,26.4 39.2,22.1 38.3,21.2 37.05,21.2 36.95,21.1
N$26  (via drill 0.5)
  Top 0.406: v16.75,21.4 16.75,21.45 15.3,22.9 v9.35,22.9
  Bottom 0.406: U1.15 16.49,21.14 v16.75,21.4 | v9.35,22.9 2.98,29.27 X4.3
N$27  (via drill 0.5)
  Top 0.406: v11.3,23.75 11.4,23.65 15.75,23.65 17.9,21.5 v17.9,21.4
  Bottom 0.406: U1.16 17.29,20.79 v17.9,21.4 | X4.2 7.57,30.84 12.1,26.3 12.35,26.05 12.45,25.95 12.45,24.9 v11.3,23.75
N$28
  Bottom 0.406: 2.98,17.17 R16.1 2.4,17.75 2.4,19.4 2.98,19.98 X3.3
  Bottom 0.6: R16.1 2.75,17.15
N$29
  Bottom 0.406: R17.1 5.88,19.15 X3.4
N$30
  Top 0.5: R13.2 30.03,9.07 32.1,7 33.3,7 35,7 35.9,6.1 JP2.2
  Bottom 0.5: C14.1 35.85,6.8 F3.2
  Bottom 2: JP2.2 35.9,6.75 F3.2 C7.+
N$31  (via drill 0.5)
  Top 0.406: v18.6,22.4 18,22.4 16.1,24.3 12.3,24.3 v11.2,25.4
  Bottom 0.406: U1.17 18.78,22.22 v18.6,22.4 | v11.2,25.4 7,29.6 4.8,29.6 2.98,31.42 X4.1
N$33  (via drill 0.5)
  Top 0.406: X6.1 17.47,37.27 16.2,36 12,36 v11.2,36.8
  Bottom 0.406: v11.2,36.8 11.2,37 10.8,37.4 F1.1
PWM  (via drill 0.5)
  Top 0.3: 11.8,17.8 11.21,17.8 U2.3 10.91,17.7
  Top 0.4: 10.91,17.7 9.9,17.7 9.4,17.2 9.4,16.8 8.9,16.3 7.6,16.3
  Top 0.406: 7.6,16.3 7.55,16.3 4.25,13 4.25,12.11 X5.6 | v13.5,13.55 13.7,13.75 13.7,15.95 11.85,17.8 11.8,17.8
  Bottom 0.5: U1.23 13.49,13.69 v13.5,13.55
PWM_D  (via drill 0.5)
  Top 0.5: U2.14 20.96,17.77 21.9,18.7 21.9,25.4 24.4,27.9 34.9,27.9 36.2,26.6 36.2,23.3 36.5,23 v37,23
  Bottom 0.3: v37,23 U3.13
RE
  Bottom 0.254: U$1.2 17.6,24 16.4,22.8 14,22.8 13.29,22.09 U1.11
RX  (via drill 0.5)
  Top 0.254: v15,25.2 15.2,25 16.4,25 17.2,24.2 18.2,24.2 v18.4,24.4
  Bottom 0.254: U1.8 10.2,18.6 11,19.4 11,20.8 11.2,21 11.2,22.4 13.2,24.4 14.4,24.4 15,25 v15,25.2 | 18.1,25.1 U$1.1 18.1,24.7 v18.4,24.4
TX
  Bottom 0.254: 11.7,19.99 11.7,22.1 13.4,23.8 16,23.8 16.6,24.4 U$1.4
  Bottom 0.5: 11.71,20 11.7,19.99 U1.9
VCC  (via drill 0.5)
  Top 0.406: U2.7 12.46,12.69 v12.6,12.55 | U2.1 9.23,20.3 7.94,21.6 | v6,16 6,16.1 6.8,16.9 6.8,17.6 6.82,17.6 6.82,19.82 7.2,20.2 7.89,20.2 C10.1 7.94,21.6 | 7.94,21.6 7.94,24.43 R3.2 7.2,25.59 v7.2,32.6 | v18.1,27.75 17.5,27.15 R4.2
  Top 0.5: 9.27,12.69 C12.1
  Top 0.6: U2.7 9.27,12.69
  Bottom 0.254: U$1.10 v18.1,27.75
  Bottom 0.406: U1.32 11.69,10.69 9.6,8.6 9.6,7.59 C4.1 10.79,7.36 12.15,6 12.15,2.75 F2.2 | U1.31 12.49,12.44 v12.6,12.55 12.6,12.6 12.2,12.6 11.6,13.2 11.6,14.6 10.9,15.3 U1.4 | C9.1 v6,16 | F1.2 7.3,34.6 C15.1 7,32.8 v7.2,32.6 12,27.8 18.05,27.8 v18.1,27.75
  Bottom 0.5: U1.32 11.69,11.09 | F2.2 12.34,2.6 C1.1 | C1.1 13.6,2.6 13.5,2.5 12.8,2.5 | 12.8,2.5 12.2,2.5 12.3,2.6 C1.1 | 12.8,2.1 12.8,2.5
  Bottom 0.6: U1.32 U1.31 | X5.2 6.37,5.76 7.96,7.36 C4.1 | C9.1 8.1,16 8.8,15.3 10.19,15.3 U1.4
Y
  Bottom 0.254: U$1.6 16.1,30.1 15.8,30.4 15,30.4 14.2,31.2 13.35,31.2 R9.1 12.35,33.05 11.4,34 11.4,34.7 X6.6
Z
  Bottom 0.254: U$1.7 16.6,30.35 16,30.95 15.3,30.95 R9.2 14.05,32.75 12.8,34 12.8,37.16 X6.5

### Text on the board
Document: RS485 | GPIO | MOTOR | v0.8 | ENC | DCH | VCC | GND